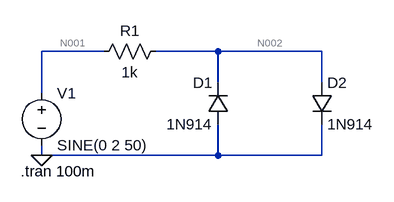
[diagram p0: schematic Draft5.asc]
Draft5.asc, the LTspice schematic file:
Version 4
SHEET 1 880 680
WIRE -48 96 -144 96
WIRE 128 96 32 96
WIRE 288 96 128 96
WIRE 128 144 128 96
WIRE 288 144 288 96
WIRE -144 160 -144 96
WIRE -144 256 -144 240
WIRE 128 256 128 208
WIRE 128 256 -144 256
WIRE 288 256 288 208
WIRE 288 256 128 256
FLAG -144 256 0
SYMBOL diode 272 144 R0
SYMATTR InstName D2
SYMATTR Value 1N914
SYMBOL diode 144 208 R180
WINDOW 0 24 64 Left 2
WINDOW 3 24 0 Left 2
SYMATTR InstName D1
SYMATTR Value 1N914
SYMBOL res 48 80 R90
WINDOW 0 0 56 VBottom 2
WINDOW 3 32 56 VTop 2
SYMATTR InstName R1
SYMATTR Value 1k
SYMBOL voltage -144 144 R0
WINDOW 123 0 0 Left 0
WINDOW 39 0 0 Left 0
SYMATTR InstName V1
SYMATTR Value SINE(0 2 50)
TEXT -176 280 Left 2 !.tran 100m

The netlist it stands for:
* Draft5.asc
D2 N002 0 1N914
D1 0 N002 1N914
R1 N002 N001 1k
V1 N001 0 SINE(0 2 50)
.model D D
.lib standard.dio
.tran 100m
.backanno
.end

* Results of the author's LTspice run, read from the files saved beside the schematic
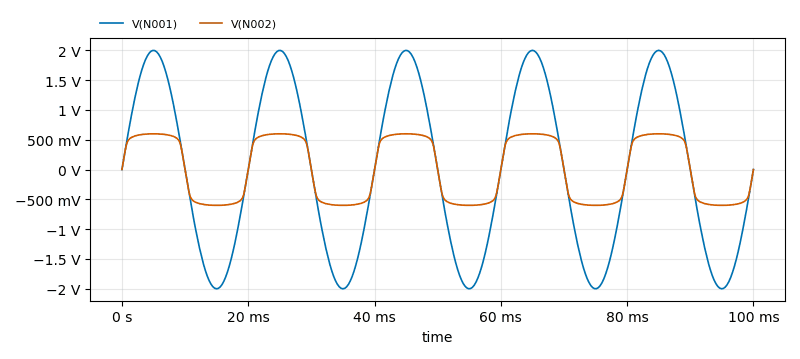
[diagram p1: Transient Analysis of Draft5.asc, plotted from the saved traces]
* Transient Analysis, 1 run:
*   V(N001): min -2 V, max 2 V, average -2.481 µV, rms 1.414 V, last 0 V
*   V(N002): min -600.2 mV, max 600.2 mV, average -2.479 µV, rms 535.2 mV, last -5.157 µV